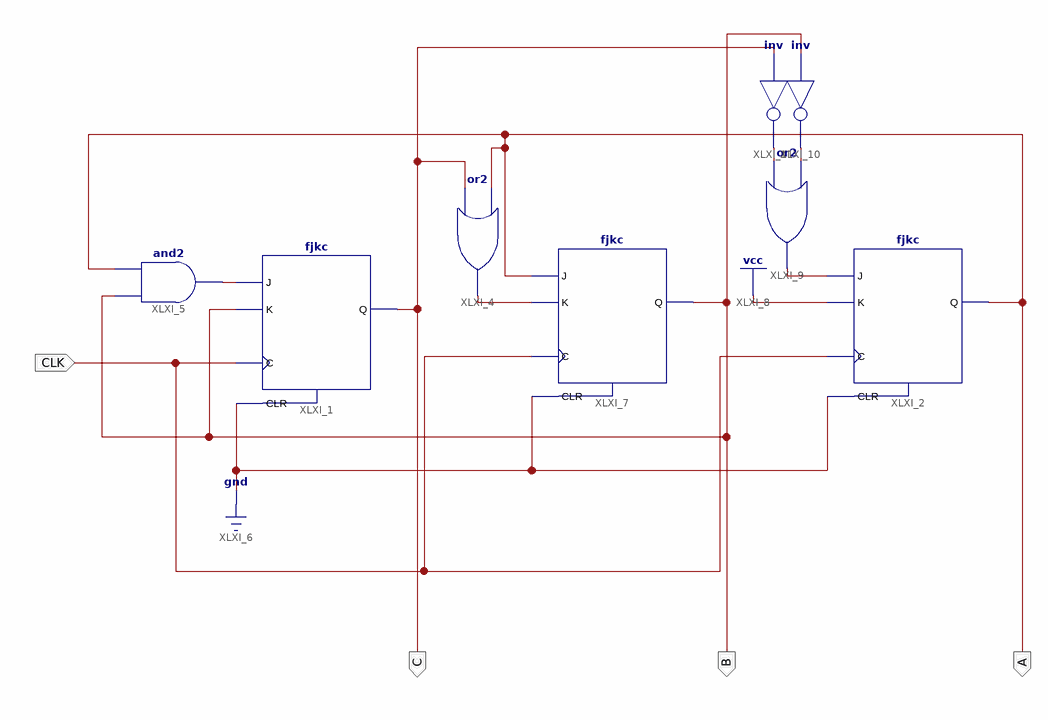
[diagram p0: schematic sheet 1]
// Xilinx ISE schematic Counter0_6.sch (spartan6) as structural Verilog: 8 symbols, 4 ports
module Counter0_6 (
  input  CLK,
  output B,
  output A,
  output C
);

  wire XLXN_2, XLXN_9, XLXN_25, XLXN_26, XLXN_27;

  fjkc XLXI_1 (.C(CLK), .CLR(1'b0), .J(XLXN_2), .K(B), .Q(C));
  fjkc XLXI_2 (.C(CLK), .CLR(1'b0), .J(XLXN_25), .K(1'b1), .Q(A));
  or XLXI_4 (XLXN_9, C, A);
  and XLXI_5 (XLXN_2, B, A);
  fjkc XLXI_7 (.C(CLK), .CLR(1'b0), .J(A), .K(XLXN_9), .Q(B));
  or XLXI_9 (XLXN_25, XLXN_26, XLXN_27);
  not XLXI_10 (XLXN_27, B);
  not XLXI_11 (XLXN_26, C);
endmodule
